# Altium project ValveBoard - Copy.PrjPcb (part 2 of 2)

## Sheet VALVEBOARD_ValvePower.SchDoc
size A4; SheetNumber: 4; SheetTotal: 9
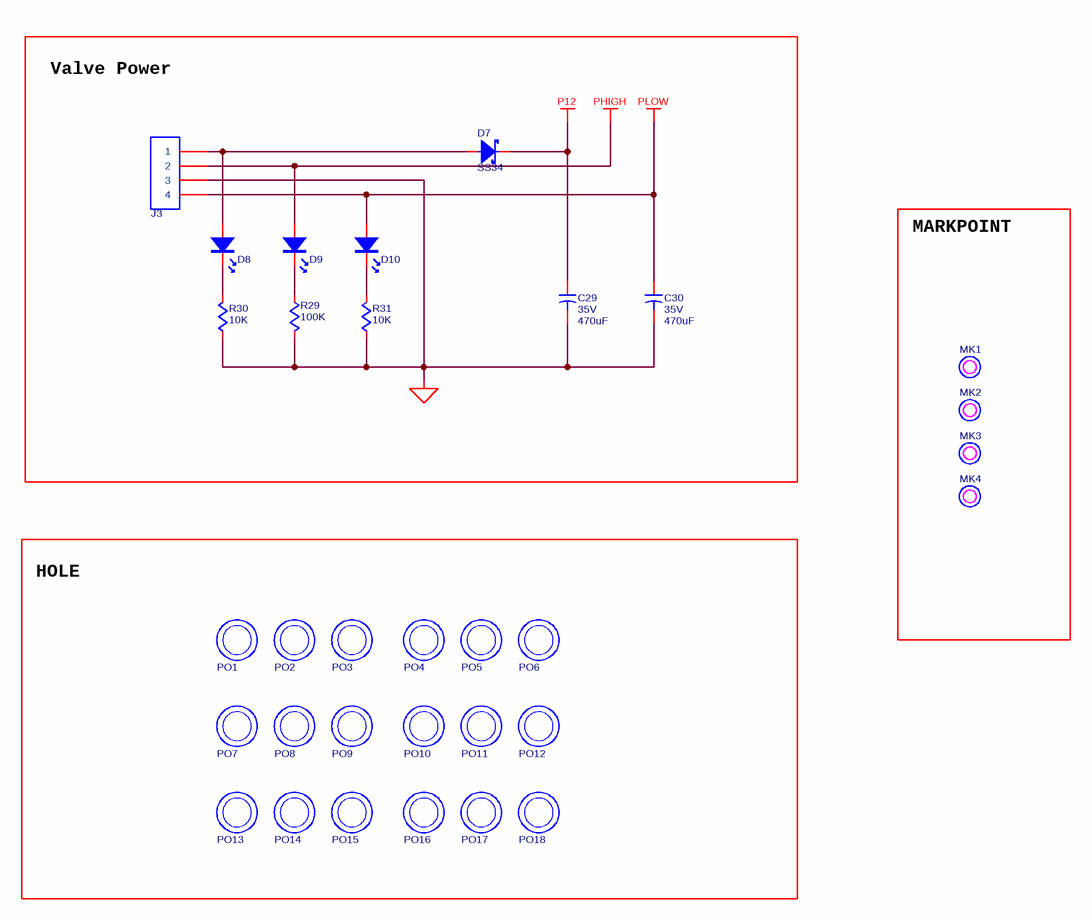
[diagram p8: VALVEBOARD_ValvePower.SchDoc]

### Parts
C29  value 470uF  voltage: 35V  [C_10_10R2]  (hidden comment: C-POL)
C30  value 470uF  voltage: 35V  [C_10_10R2]  (hidden comment: C-POL)
D7  SS34  [SS34]
D8  LED  [LED0603]  (value not drawn)
D9  LED  [LED0603]  (value not drawn)
D10  LED  [LED0603]  (value not drawn)
J3  HDR1X4  [KF301-5.0-4P]  (value not drawn)
MK1  MARKPOINT  [MARKPOINT-1.0]  (value not drawn)
MK2  MARKPOINT  [MARKPOINT-1.0]  (value not drawn)
MK3  MARKPOINT  [MARKPOINT-1.0]  (value not drawn)
MK4  MARKPOINT  [MARKPOINT-1.0]  (value not drawn)
PO1  POSHOLE  [POSHOLE-3.2]  (value not drawn)
PO2  POSHOLE  [POSHOLE-3.2]  (value not drawn)
PO3  POSHOLE  [POSHOLE-3.2]  (value not drawn)
PO4  POSHOLE  [POSHOLE-3.2]  (value not drawn)
PO5  POSHOLE  [POSHOLE-3.2]  (value not drawn)
PO6  POSHOLE  [POSHOLE-3.2]  (value not drawn)
PO7  POSHOLE  [POSHOLE-3.2]  (value not drawn)
PO8  POSHOLE  [POSHOLE-3.2]  (value not drawn)
PO9  POSHOLE  [POSHOLE-3.2]  (value not drawn)
PO10  POSHOLE  [POSHOLE-3.2]  (value not drawn)
PO11  POSHOLE  [POSHOLE-3.2]  (value not drawn)
PO12  POSHOLE  [POSHOLE-3.2]  (value not drawn)
PO13  POSHOLE  [POSHOLE-3.2]  (value not drawn)
PO14  POSHOLE  [POSHOLE-3.2]  (value not drawn)
PO15  POSHOLE  [POSHOLE-3.2]  (value not drawn)
PO16  POSHOLE  [POSHOLE-3.2]  (value not drawn)
PO17  POSHOLE  [POSHOLE-3.2]  (value not drawn)
PO18  POSHOLE  [POSHOLE-3.2]  (value not drawn)
R29  value 100K  [R1206]  (hidden comment: R)
R30  value 10K  [R0805]  (hidden comment: R)
R31  value 10K  [R0805]  (hidden comment: R)

### Blocks framed on the sheet
Valve Power: C29 C30 D7-D10 J3 R29-R31
MARKPOINT: MK1-MK4
HOLE: PO1-PO18

### Nets
P12: C29.1(S) D7.1
PGND: C29.2 C30.2 J3.3 R29.1 R30.2 R31.2
PHIGH: D9.2 J3.2
PLOW: C30.1(S) D10.2 J3.4
NetD7_2: D7.2 D8.2 J3.1
NetD8_1: D8.1 R30.1
NetD9_1: D9.1 R29.2
NetD10_1: D10.1 R31.1

### Library data of the parts
R29-R31 = R: precision: 1%
D7 = SS34: Supplier 1: LCSC; Supplier Part Number 1: C8678

## Nets that join several sheets
DGND: VALVEBOARD_Controller (35 pins), VALVEBOARD_DigitalInterface (13 pins), VALVEBOARD_DigitalPower (29 pins)
P12: PostIsolation1/Isolation (16 pins), PostIsolation2/Isolation (16 pins), PostIsolation3/Isolation (16 pins), PostIsolation4/Isolation (16 pins), PostIsolation5/Isolation (16 pins), PostIsolation6/Isolation (16 pins), PostIsolation7/Isolation (16 pins), PostIsolation8/Isolation (16 pins), PostIsolation9/Isolation (16 pins), PostIsolation10/Isolation (16 pins), PostIsolation11/Isolation (16 pins), PostIsolation12/Isolation (16 pins), VALVEBOARD_ValvePower (C29.1 D7.1)
PGND: PostIsolation1/Isolation (8 pins), PostIsolation1/Drive1 (7 pins), PostIsolation1/Drive2 (7 pins), PostIsolation1/Drive3 (7 pins), PostIsolation1/Drive4 (7 pins), PostIsolation2/Isolation (8 pins), PostIsolation2/Drive1 (7 pins), PostIsolation2/Drive2 (7 pins), PostIsolation2/Drive3 (7 pins), PostIsolation2/Drive4 (7 pins), PostIsolation3/Isolation (8 pins), PostIsolation3/Drive1 (7 pins), PostIsolation3/Drive2 (7 pins), PostIsolation3/Drive3 (7 pins), PostIsolation3/Drive4 (7 pins), PostIsolation4/Isolation (8 pins), PostIsolation4/Drive1 (7 pins), PostIsolation4/Drive2 (7 pins), PostIsolation4/Drive3 (7 pins), PostIsolation4/Drive4 (7 pins), PostIsolation5/Isolation (8 pins), PostIsolation5/Drive1 (7 pins), PostIsolation5/Drive2 (7 pins), PostIsolation5/Drive3 (7 pins), PostIsolation5/Drive4 (7 pins), PostIsolation6/Isolation (8 pins), PostIsolation6/Drive1 (7 pins), PostIsolation6/Drive2 (7 pins), PostIsolation6/Drive3 (7 pins), PostIsolation6/Drive4 (7 pins), PostIsolation7/Isolation (8 pins), PostIsolation7/Drive1 (7 pins), PostIsolation7/Drive2 (7 pins), PostIsolation7/Drive3 (7 pins), PostIsolation7/Drive4 (7 pins), PostIsolation8/Isolation (8 pins), PostIsolation8/Drive1 (7 pins), PostIsolation8/Drive2 (7 pins), PostIsolation8/Drive3 (7 pins), PostIsolation8/Drive4 (7 pins), PostIsolation9/Isolation (8 pins), PostIsolation9/Drive1 (7 pins), PostIsolation9/Drive2 (7 pins), PostIsolation9/Drive3 (7 pins), PostIsolation9/Drive4 (7 pins), PostIsolation10/Isolation (8 pins), PostIsolation10/Drive1 (7 pins), PostIsolation10/Drive2 (7 pins), PostIsolation10/Drive3 (7 pins), PostIsolation10/Drive4 (7 pins), PostIsolation11/Isolation (8 pins), PostIsolation11/Drive1 (7 pins), PostIsolation11/Drive2 (7 pins), PostIsolation11/Drive3 (7 pins), PostIsolation11/Drive4 (7 pins), PostIsolation12/Isolation (8 pins), PostIsolation12/Drive1 (7 pins), PostIsolation12/Drive2 (7 pins), PostIsolation12/Drive3 (7 pins), PostIsolation12/Drive4 (7 pins), VALVEBOARD_ValvePower (6 pins)
PHIGH: PostIsolation1/Drive1 (D5_PostIsolation1_Drive1.1 Q1_PostIsolation1_Drive1.3 R22_PostIsolation1_Drive1.2 R23_PostIsolation1_Drive1.2), PostIsolation1/Drive2 (D5_PostIsolation1_Drive2.1 Q1_PostIsolation1_Drive2.3 R22_PostIsolation1_Drive2.2 R23_PostIsolation1_Drive2.2), PostIsolation1/Drive3 (D5_PostIsolation1_Drive3.1 Q1_PostIsolation1_Drive3.3 R22_PostIsolation1_Drive3.2 R23_PostIsolation1_Drive3.2), PostIsolation1/Drive4 (D5_PostIsolation1_Drive4.1 Q1_PostIsolation1_Drive4.3 R22_PostIsolation1_Drive4.2 R23_PostIsolation1_Drive4.2), PostIsolation2/Drive1 (D5_PostIsolation2_Drive1.1 Q1_PostIsolation2_Drive1.3 R22_PostIsolation2_Drive1.2 R23_PostIsolation2_Drive1.2), PostIsolation2/Drive2 (D5_PostIsolation2_Drive2.1 Q1_PostIsolation2_Drive2.3 R22_PostIsolation2_Drive2.2 R23_PostIsolation2_Drive2.2), PostIsolation2/Drive3 (D5_PostIsolation2_Drive3.1 Q1_PostIsolation2_Drive3.3 R22_PostIsolation2_Drive3.2 R23_PostIsolation2_Drive3.2), PostIsolation2/Drive4 (D5_PostIsolation2_Drive4.1 Q1_PostIsolation2_Drive4.3 R22_PostIsolation2_Drive4.2 R23_PostIsolation2_Drive4.2), PostIsolation3/Drive1 (D5_PostIsolation3_Drive1.1 Q1_PostIsolation3_Drive1.3 R22_PostIsolation3_Drive1.2 R23_PostIsolation3_Drive1.2), PostIsolation3/Drive2 (D5_PostIsolation3_Drive2.1 Q1_PostIsolation3_Drive2.3 R22_PostIsolation3_Drive2.2 R23_PostIsolation3_Drive2.2), PostIsolation3/Drive3 (D5_PostIsolation3_Drive3.1 Q1_PostIsolation3_Drive3.3 R22_PostIsolation3_Drive3.2 R23_PostIsolation3_Drive3.2), PostIsolation3/Drive4 (D5_PostIsolation3_Drive4.1 Q1_PostIsolation3_Drive4.3 R22_PostIsolation3_Drive4.2 R23_PostIsolation3_Drive4.2), PostIsolation4/Drive1 (D5_PostIsolation4_Drive1.1 Q1_PostIsolation4_Drive1.3 R22_PostIsolation4_Drive1.2 R23_PostIsolation4_Drive1.2), PostIsolation4/Drive2 (D5_PostIsolation4_Drive2.1 Q1_PostIsolation4_Drive2.3 R22_PostIsolation4_Drive2.2 R23_PostIsolation4_Drive2.2), PostIsolation4/Drive3 (D5_PostIsolation4_Drive3.1 Q1_PostIsolation4_Drive3.3 R22_PostIsolation4_Drive3.2 R23_PostIsolation4_Drive3.2), PostIsolation4/Drive4 (D5_PostIsolation4_Drive4.1 Q1_PostIsolation4_Drive4.3 R22_PostIsolation4_Drive4.2 R23_PostIsolation4_Drive4.2), PostIsolation5/Drive1 (D5_PostIsolation5_Drive1.1 Q1_PostIsolation5_Drive1.3 R22_PostIsolation5_Drive1.2 R23_PostIsolation5_Drive1.2), PostIsolation5/Drive2 (D5_PostIsolation5_Drive2.1 Q1_PostIsolation5_Drive2.3 R22_PostIsolation5_Drive2.2 R23_PostIsolation5_Drive2.2), PostIsolation5/Drive3 (D5_PostIsolation5_Drive3.1 Q1_PostIsolation5_Drive3.3 R22_PostIsolation5_Drive3.2 R23_PostIsolation5_Drive3.2), PostIsolation5/Drive4 (D5_PostIsolation5_Drive4.1 Q1_PostIsolation5_Drive4.3 R22_PostIsolation5_Drive4.2 R23_PostIsolation5_Drive4.2), PostIsolation6/Drive1 (D5_PostIsolation6_Drive1.1 Q1_PostIsolation6_Drive1.3 R22_PostIsolation6_Drive1.2 R23_PostIsolation6_Drive1.2), PostIsolation6/Drive2 (D5_PostIsolation6_Drive2.1 Q1_PostIsolation6_Drive2.3 R22_PostIsolation6_Drive2.2 R23_PostIsolation6_Drive2.2), PostIsolation6/Drive3 (D5_PostIsolation6_Drive3.1 Q1_PostIsolation6_Drive3.3 R22_PostIsolation6_Drive3.2 R23_PostIsolation6_Drive3.2), PostIsolation6/Drive4 (D5_PostIsolation6_Drive4.1 Q1_PostIsolation6_Drive4.3 R22_PostIsolation6_Drive4.2 R23_PostIsolation6_Drive4.2), PostIsolation7/Drive1 (D5_PostIsolation7_Drive1.1 Q1_PostIsolation7_Drive1.3 R22_PostIsolation7_Drive1.2 R23_PostIsolation7_Drive1.2), PostIsolation7/Drive2 (D5_PostIsolation7_Drive2.1 Q1_PostIsolation7_Drive2.3 R22_PostIsolation7_Drive2.2 R23_PostIsolation7_Drive2.2), PostIsolation7/Drive3 (D5_PostIsolation7_Drive3.1 Q1_PostIsolation7_Drive3.3 R22_PostIsolation7_Drive3.2 R23_PostIsolation7_Drive3.2), PostIsolation7/Drive4 (D5_PostIsolation7_Drive4.1 Q1_PostIsolation7_Drive4.3 R22_PostIsolation7_Drive4.2 R23_PostIsolation7_Drive4.2), PostIsolation8/Drive1 (D5_PostIsolation8_Drive1.1 Q1_PostIsolation8_Drive1.3 R22_PostIsolation8_Drive1.2 R23_PostIsolation8_Drive1.2), PostIsolation8/Drive2 (D5_PostIsolation8_Drive2.1 Q1_PostIsolation8_Drive2.3 R22_PostIsolation8_Drive2.2 R23_PostIsolation8_Drive2.2), PostIsolation8/Drive3 (D5_PostIsolation8_Drive3.1 Q1_PostIsolation8_Drive3.3 R22_PostIsolation8_Drive3.2 R23_PostIsolation8_Drive3.2), PostIsolation8/Drive4 (D5_PostIsolation8_Drive4.1 Q1_PostIsolation8_Drive4.3 R22_PostIsolation8_Drive4.2 R23_PostIsolation8_Drive4.2), PostIsolation9/Drive1 (D5_PostIsolation9_Drive1.1 Q1_PostIsolation9_Drive1.3 R22_PostIsolation9_Drive1.2 R23_PostIsolation9_Drive1.2), PostIsolation9/Drive2 (D5_PostIsolation9_Drive2.1 Q1_PostIsolation9_Drive2.3 R22_PostIsolation9_Drive2.2 R23_PostIsolation9_Drive2.2), PostIsolation9/Drive3 (D5_PostIsolation9_Drive3.1 Q1_PostIsolation9_Drive3.3 R22_PostIsolation9_Drive3.2 R23_PostIsolation9_Drive3.2), PostIsolation9/Drive4 (D5_PostIsolation9_Drive4.1 Q1_PostIsolation9_Drive4.3 R22_PostIsolation9_Drive4.2 R23_PostIsolation9_Drive4.2), PostIsolation10/Drive1 (D5_PostIsolation10_Drive1.1 Q1_PostIsolation10_Drive1.3 R22_PostIsolation10_Drive1.2 R23_PostIsolation10_Drive1.2), PostIsolation10/Drive2 (D5_PostIsolation10_Drive2.1 Q1_PostIsolation10_Drive2.3 R22_PostIsolation10_Drive2.2 R23_PostIsolation10_Drive2.2), PostIsolation10/Drive3 (D5_PostIsolation10_Drive3.1 Q1_PostIsolation10_Drive3.3 R22_PostIsolation10_Drive3.2 R23_PostIsolation10_Drive3.2), PostIsolation10/Drive4 (D5_PostIsolation10_Drive4.1 Q1_PostIsolation10_Drive4.3 R22_PostIsolation10_Drive4.2 R23_PostIsolation10_Drive4.2), PostIsolation11/Drive1 (D5_PostIsolation11_Drive1.1 Q1_PostIsolation11_Drive1.3 R22_PostIsolation11_Drive1.2 R23_PostIsolation11_Drive1.2), PostIsolation11/Drive2 (D5_PostIsolation11_Drive2.1 Q1_PostIsolation11_Drive2.3 R22_PostIsolation11_Drive2.2 R23_PostIsolation11_Drive2.2), PostIsolation11/Drive3 (D5_PostIsolation11_Drive3.1 Q1_PostIsolation11_Drive3.3 R22_PostIsolation11_Drive3.2 R23_PostIsolation11_Drive3.2), PostIsolation11/Drive4 (D5_PostIsolation11_Drive4.1 Q1_PostIsolation11_Drive4.3 R22_PostIsolation11_Drive4.2 R23_PostIsolation11_Drive4.2), PostIsolation12/Drive1 (D5_PostIsolation12_Drive1.1 Q1_PostIsolation12_Drive1.3 R22_PostIsolation12_Drive1.2 R23_PostIsolation12_Drive1.2), PostIsolation12/Drive2 (D5_PostIsolation12_Drive2.1 Q1_PostIsolation12_Drive2.3 R22_PostIsolation12_Drive2.2 R23_PostIsolation12_Drive2.2), PostIsolation12/Drive3 (D5_PostIsolation12_Drive3.1 Q1_PostIsolation12_Drive3.3 R22_PostIsolation12_Drive3.2 R23_PostIsolation12_Drive3.2), PostIsolation12/Drive4 (D5_PostIsolation12_Drive4.1 Q1_PostIsolation12_Drive4.3 R22_PostIsolation12_Drive4.2 R23_PostIsolation12_Drive4.2), VALVEBOARD_ValvePower (D9.2 J3.2)
PLOW: PostIsolation1/Drive1 (D6_PostIsolation1_Drive1.2), PostIsolation1/Drive2 (D6_PostIsolation1_Drive2.2), PostIsolation1/Drive3 (D6_PostIsolation1_Drive3.2), PostIsolation1/Drive4 (D6_PostIsolation1_Drive4.2), PostIsolation2/Drive1 (D6_PostIsolation2_Drive1.2), PostIsolation2/Drive2 (D6_PostIsolation2_Drive2.2), PostIsolation2/Drive3 (D6_PostIsolation2_Drive3.2), PostIsolation2/Drive4 (D6_PostIsolation2_Drive4.2), PostIsolation3/Drive1 (D6_PostIsolation3_Drive1.2), PostIsolation3/Drive2 (D6_PostIsolation3_Drive2.2), PostIsolation3/Drive3 (D6_PostIsolation3_Drive3.2), PostIsolation3/Drive4 (D6_PostIsolation3_Drive4.2), PostIsolation4/Drive1 (D6_PostIsolation4_Drive1.2), PostIsolation4/Drive2 (D6_PostIsolation4_Drive2.2), PostIsolation4/Drive3 (D6_PostIsolation4_Drive3.2), PostIsolation4/Drive4 (D6_PostIsolation4_Drive4.2), PostIsolation5/Drive1 (D6_PostIsolation5_Drive1.2), PostIsolation5/Drive2 (D6_PostIsolation5_Drive2.2), PostIsolation5/Drive3 (D6_PostIsolation5_Drive3.2), PostIsolation5/Drive4 (D6_PostIsolation5_Drive4.2), PostIsolation6/Drive1 (D6_PostIsolation6_Drive1.2), PostIsolation6/Drive2 (D6_PostIsolation6_Drive2.2), PostIsolation6/Drive3 (D6_PostIsolation6_Drive3.2), PostIsolation6/Drive4 (D6_PostIsolation6_Drive4.2), PostIsolation7/Drive1 (D6_PostIsolation7_Drive1.2), PostIsolation7/Drive2 (D6_PostIsolation7_Drive2.2), PostIsolation7/Drive3 (D6_PostIsolation7_Drive3.2), PostIsolation7/Drive4 (D6_PostIsolation7_Drive4.2), PostIsolation8/Drive1 (D6_PostIsolation8_Drive1.2), PostIsolation8/Drive2 (D6_PostIsolation8_Drive2.2), PostIsolation8/Drive3 (D6_PostIsolation8_Drive3.2), PostIsolation8/Drive4 (D6_PostIsolation8_Drive4.2), PostIsolation9/Drive1 (D6_PostIsolation9_Drive1.2), PostIsolation9/Drive2 (D6_PostIsolation9_Drive2.2), PostIsolation9/Drive3 (D6_PostIsolation9_Drive3.2), PostIsolation9/Drive4 (D6_PostIsolation9_Drive4.2), PostIsolation10/Drive1 (D6_PostIsolation10_Drive1.2), PostIsolation10/Drive2 (D6_PostIsolation10_Drive2.2), PostIsolation10/Drive3 (D6_PostIsolation10_Drive3.2), PostIsolation10/Drive4 (D6_PostIsolation10_Drive4.2), PostIsolation11/Drive1 (D6_PostIsolation11_Drive1.2), PostIsolation11/Drive2 (D6_PostIsolation11_Drive2.2), PostIsolation11/Drive3 (D6_PostIsolation11_Drive3.2), PostIsolation11/Drive4 (D6_PostIsolation11_Drive4.2), PostIsolation12/Drive1 (D6_PostIsolation12_Drive1.2), PostIsolation12/Drive2 (D6_PostIsolation12_Drive2.2), PostIsolation12/Drive3 (D6_PostIsolation12_Drive3.2), PostIsolation12/Drive4 (D6_PostIsolation12_Drive4.2), VALVEBOARD_ValvePower (C30.1 D10.2 J3.4)
VCC3.3: VALVEBOARD_Controller (34 pins), VALVEBOARD_DigitalInterface (8 pins), VALVEBOARD_DigitalPower (10 pins)
VCC3.3GG: PostIsolation1/Isolation (8 pins), PostIsolation2/Isolation (8 pins), PostIsolation3/Isolation (8 pins), PostIsolation4/Isolation (8 pins), PostIsolation5/Isolation (8 pins), PostIsolation6/Isolation (8 pins), PostIsolation7/Isolation (8 pins), PostIsolation8/Isolation (8 pins), PostIsolation9/Isolation (8 pins), PostIsolation10/Isolation (8 pins), PostIsolation11/Isolation (8 pins), PostIsolation12/Isolation (8 pins), VALVEBOARD_DigitalPower (C39.2 LED1.2 Q4.D R43.2)
DLO1_PostIsolation1: PostIsolation1/Interface (C23_PostIsolation1_Interface.2 J2_PostIsolation1_Interface.1), PostIsolation1/Drive1 (Q2_PostIsolation1_Drive1.2)
DLO1_PostIsolation2: PostIsolation2/Interface (C23_PostIsolation2_Interface.2 J2_PostIsolation2_Interface.1), PostIsolation2/Drive1 (Q2_PostIsolation2_Drive1.2)
DLO1_PostIsolation3: PostIsolation3/Interface (C23_PostIsolation3_Interface.2 J2_PostIsolation3_Interface.1), PostIsolation3/Drive1 (Q2_PostIsolation3_Drive1.2)
DLO1_PostIsolation4: PostIsolation4/Interface (C23_PostIsolation4_Interface.2 J2_PostIsolation4_Interface.1), PostIsolation4/Drive1 (Q2_PostIsolation4_Drive1.2)
DLO1_PostIsolation5: PostIsolation5/Interface (C23_PostIsolation5_Interface.2 J2_PostIsolation5_Interface.1), PostIsolation5/Drive1 (Q2_PostIsolation5_Drive1.2)
DLO1_PostIsolation6: PostIsolation6/Interface (C23_PostIsolation6_Interface.2 J2_PostIsolation6_Interface.1), PostIsolation6/Drive1 (Q2_PostIsolation6_Drive1.2)
DLO1_PostIsolation7: PostIsolation7/Interface (C23_PostIsolation7_Interface.2 J2_PostIsolation7_Interface.1), PostIsolation7/Drive1 (Q2_PostIsolation7_Drive1.2)
DLO1_PostIsolation8: PostIsolation8/Interface (C23_PostIsolation8_Interface.2 J2_PostIsolation8_Interface.1), PostIsolation8/Drive1 (Q2_PostIsolation8_Drive1.2)
DLO1_PostIsolation9: PostIsolation9/Interface (C23_PostIsolation9_Interface.2 J2_PostIsolation9_Interface.1), PostIsolation9/Drive1 (Q2_PostIsolation9_Drive1.2)
DLO1_PostIsolation10: PostIsolation10/Interface (C23_PostIsolation10_Interface.2 J2_PostIsolation10_Interface.1), PostIsolation10/Drive1 (Q2_PostIsolation10_Drive1.2)
DLO1_PostIsolation11: PostIsolation11/Interface (C23_PostIsolation11_Interface.2 J2_PostIsolation11_Interface.1), PostIsolation11/Drive1 (Q2_PostIsolation11_Drive1.2)
DLO1_PostIsolation12: PostIsolation12/Interface (C23_PostIsolation12_Interface.2 J2_PostIsolation12_Interface.1), PostIsolation12/Drive1 (Q2_PostIsolation12_Drive1.2)
DLO2_PostIsolation1: PostIsolation1/Interface (C24_PostIsolation1_Interface.2 J2_PostIsolation1_Interface.3), PostIsolation1/Drive2 (Q2_PostIsolation1_Drive2.2)
DLO2_PostIsolation2: PostIsolation2/Interface (C24_PostIsolation2_Interface.2 J2_PostIsolation2_Interface.3), PostIsolation2/Drive2 (Q2_PostIsolation2_Drive2.2)
DLO2_PostIsolation3: PostIsolation3/Interface (C24_PostIsolation3_Interface.2 J2_PostIsolation3_Interface.3), PostIsolation3/Drive2 (Q2_PostIsolation3_Drive2.2)
DLO2_PostIsolation4: PostIsolation4/Interface (C24_PostIsolation4_Interface.2 J2_PostIsolation4_Interface.3), PostIsolation4/Drive2 (Q2_PostIsolation4_Drive2.2)
DLO2_PostIsolation5: PostIsolation5/Interface (C24_PostIsolation5_Interface.2 J2_PostIsolation5_Interface.3), PostIsolation5/Drive2 (Q2_PostIsolation5_Drive2.2)
DLO2_PostIsolation6: PostIsolation6/Interface (C24_PostIsolation6_Interface.2 J2_PostIsolation6_Interface.3), PostIsolation6/Drive2 (Q2_PostIsolation6_Drive2.2)
DLO2_PostIsolation7: PostIsolation7/Interface (C24_PostIsolation7_Interface.2 J2_PostIsolation7_Interface.3), PostIsolation7/Drive2 (Q2_PostIsolation7_Drive2.2)
DLO2_PostIsolation8: PostIsolation8/Interface (C24_PostIsolation8_Interface.2 J2_PostIsolation8_Interface.3), PostIsolation8/Drive2 (Q2_PostIsolation8_Drive2.2)
DLO2_PostIsolation9: PostIsolation9/Interface (C24_PostIsolation9_Interface.2 J2_PostIsolation9_Interface.3), PostIsolation9/Drive2 (Q2_PostIsolation9_Drive2.2)
DLO2_PostIsolation10: PostIsolation10/Interface (C24_PostIsolation10_Interface.2 J2_PostIsolation10_Interface.3), PostIsolation10/Drive2 (Q2_PostIsolation10_Drive2.2)
DLO2_PostIsolation11: PostIsolation11/Interface (C24_PostIsolation11_Interface.2 J2_PostIsolation11_Interface.3), PostIsolation11/Drive2 (Q2_PostIsolation11_Drive2.2)
DLO2_PostIsolation12: PostIsolation12/Interface (C24_PostIsolation12_Interface.2 J2_PostIsolation12_Interface.3), PostIsolation12/Drive2 (Q2_PostIsolation12_Drive2.2)
DLO3_PostIsolation1: PostIsolation1/Interface (C25_PostIsolation1_Interface.2 J2_PostIsolation1_Interface.5), PostIsolation1/Drive3 (Q2_PostIsolation1_Drive3.2)
DLO3_PostIsolation2: PostIsolation2/Interface (C25_PostIsolation2_Interface.2 J2_PostIsolation2_Interface.5), PostIsolation2/Drive3 (Q2_PostIsolation2_Drive3.2)
DLO3_PostIsolation3: PostIsolation3/Interface (C25_PostIsolation3_Interface.2 J2_PostIsolation3_Interface.5), PostIsolation3/Drive3 (Q2_PostIsolation3_Drive3.2)
DLO3_PostIsolation4: PostIsolation4/Interface (C25_PostIsolation4_Interface.2 J2_PostIsolation4_Interface.5), PostIsolation4/Drive3 (Q2_PostIsolation4_Drive3.2)
DLO3_PostIsolation5: PostIsolation5/Interface (C25_PostIsolation5_Interface.2 J2_PostIsolation5_Interface.5), PostIsolation5/Drive3 (Q2_PostIsolation5_Drive3.2)
DLO3_PostIsolation6: PostIsolation6/Interface (C25_PostIsolation6_Interface.2 J2_PostIsolation6_Interface.5), PostIsolation6/Drive3 (Q2_PostIsolation6_Drive3.2)
DLO3_PostIsolation7: PostIsolation7/Interface (C25_PostIsolation7_Interface.2 J2_PostIsolation7_Interface.5), PostIsolation7/Drive3 (Q2_PostIsolation7_Drive3.2)
DLO3_PostIsolation8: PostIsolation8/Interface (C25_PostIsolation8_Interface.2 J2_PostIsolation8_Interface.5), PostIsolation8/Drive3 (Q2_PostIsolation8_Drive3.2)
DLO3_PostIsolation9: PostIsolation9/Interface (C25_PostIsolation9_Interface.2 J2_PostIsolation9_Interface.5), PostIsolation9/Drive3 (Q2_PostIsolation9_Drive3.2)
DLO3_PostIsolation10: PostIsolation10/Interface (C25_PostIsolation10_Interface.2 J2_PostIsolation10_Interface.5), PostIsolation10/Drive3 (Q2_PostIsolation10_Drive3.2)
DLO3_PostIsolation11: PostIsolation11/Interface (C25_PostIsolation11_Interface.2 J2_PostIsolation11_Interface.5), PostIsolation11/Drive3 (Q2_PostIsolation11_Drive3.2)
DLO3_PostIsolation12: PostIsolation12/Interface (C25_PostIsolation12_Interface.2 J2_PostIsolation12_Interface.5), PostIsolation12/Drive3 (Q2_PostIsolation12_Drive3.2)
DLO4_PostIsolation1: PostIsolation1/Interface (C26_PostIsolation1_Interface.2 J2_PostIsolation1_Interface.7), PostIsolation1/Drive4 (Q2_PostIsolation1_Drive4.2)
DLO4_PostIsolation2: PostIsolation2/Interface (C26_PostIsolation2_Interface.2 J2_PostIsolation2_Interface.7), PostIsolation2/Drive4 (Q2_PostIsolation2_Drive4.2)
DLO4_PostIsolation3: PostIsolation3/Interface (C26_PostIsolation3_Interface.2 J2_PostIsolation3_Interface.7), PostIsolation3/Drive4 (Q2_PostIsolation3_Drive4.2)
DLO4_PostIsolation4: PostIsolation4/Interface (C26_PostIsolation4_Interface.2 J2_PostIsolation4_Interface.7), PostIsolation4/Drive4 (Q2_PostIsolation4_Drive4.2)
DLO4_PostIsolation5: PostIsolation5/Interface (C26_PostIsolation5_Interface.2 J2_PostIsolation5_Interface.7), PostIsolation5/Drive4 (Q2_PostIsolation5_Drive4.2)
DLO4_PostIsolation6: PostIsolation6/Interface (C26_PostIsolation6_Interface.2 J2_PostIsolation6_Interface.7), PostIsolation6/Drive4 (Q2_PostIsolation6_Drive4.2)
DLO4_PostIsolation7: PostIsolation7/Interface (C26_PostIsolation7_Interface.2 J2_PostIsolation7_Interface.7), PostIsolation7/Drive4 (Q2_PostIsolation7_Drive4.2)
DLO4_PostIsolation8: PostIsolation8/Interface (C26_PostIsolation8_Interface.2 J2_PostIsolation8_Interface.7), PostIsolation8/Drive4 (Q2_PostIsolation8_Drive4.2)
DLO4_PostIsolation9: PostIsolation9/Interface (C26_PostIsolation9_Interface.2 J2_PostIsolation9_Interface.7), PostIsolation9/Drive4 (Q2_PostIsolation9_Drive4.2)
DLO4_PostIsolation10: PostIsolation10/Interface (C26_PostIsolation10_Interface.2 J2_PostIsolation10_Interface.7), PostIsolation10/Drive4 (Q2_PostIsolation10_Drive4.2)
DLO4_PostIsolation11: PostIsolation11/Interface (C26_PostIsolation11_Interface.2 J2_PostIsolation11_Interface.7), PostIsolation11/Drive4 (Q2_PostIsolation11_Drive4.2)
DLO4_PostIsolation12: PostIsolation12/Interface (C26_PostIsolation12_Interface.2 J2_PostIsolation12_Interface.7), PostIsolation12/Drive4 (Q2_PostIsolation12_Drive4.2)
DUO1_PostIsolation1: PostIsolation1/Interface (C23_PostIsolation1_Interface.1 J2_PostIsolation1_Interface.2), PostIsolation1/Drive1 (D6_PostIsolation1_Drive1.1 Q1_PostIsolation1_Drive1.2 R23_PostIsolation1_Drive1.1)
DUO1_PostIsolation2: PostIsolation2/Interface (C23_PostIsolation2_Interface.1 J2_PostIsolation2_Interface.2), PostIsolation2/Drive1 (D6_PostIsolation2_Drive1.1 Q1_PostIsolation2_Drive1.2 R23_PostIsolation2_Drive1.1)
DUO1_PostIsolation3: PostIsolation3/Interface (C23_PostIsolation3_Interface.1 J2_PostIsolation3_Interface.2), PostIsolation3/Drive1 (D6_PostIsolation3_Drive1.1 Q1_PostIsolation3_Drive1.2 R23_PostIsolation3_Drive1.1)
DUO1_PostIsolation4: PostIsolation4/Interface (C23_PostIsolation4_Interface.1 J2_PostIsolation4_Interface.2), PostIsolation4/Drive1 (D6_PostIsolation4_Drive1.1 Q1_PostIsolation4_Drive1.2 R23_PostIsolation4_Drive1.1)
DUO1_PostIsolation5: PostIsolation5/Interface (C23_PostIsolation5_Interface.1 J2_PostIsolation5_Interface.2), PostIsolation5/Drive1 (D6_PostIsolation5_Drive1.1 Q1_PostIsolation5_Drive1.2 R23_PostIsolation5_Drive1.1)
DUO1_PostIsolation6: PostIsolation6/Interface (C23_PostIsolation6_Interface.1 J2_PostIsolation6_Interface.2), PostIsolation6/Drive1 (D6_PostIsolation6_Drive1.1 Q1_PostIsolation6_Drive1.2 R23_PostIsolation6_Drive1.1)
DUO1_PostIsolation7: PostIsolation7/Interface (C23_PostIsolation7_Interface.1 J2_PostIsolation7_Interface.2), PostIsolation7/Drive1 (D6_PostIsolation7_Drive1.1 Q1_PostIsolation7_Drive1.2 R23_PostIsolation7_Drive1.1)
DUO1_PostIsolation8: PostIsolation8/Interface (C23_PostIsolation8_Interface.1 J2_PostIsolation8_Interface.2), PostIsolation8/Drive1 (D6_PostIsolation8_Drive1.1 Q1_PostIsolation8_Drive1.2 R23_PostIsolation8_Drive1.1)
DUO1_PostIsolation9: PostIsolation9/Interface (C23_PostIsolation9_Interface.1 J2_PostIsolation9_Interface.2), PostIsolation9/Drive1 (D6_PostIsolation9_Drive1.1 Q1_PostIsolation9_Drive1.2 R23_PostIsolation9_Drive1.1)
DUO1_PostIsolation10: PostIsolation10/Interface (C23_PostIsolation10_Interface.1 J2_PostIsolation10_Interface.2), PostIsolation10/Drive1 (D6_PostIsolation10_Drive1.1 Q1_PostIsolation10_Drive1.2 R23_PostIsolation10_Drive1.1)
DUO1_PostIsolation11: PostIsolation11/Interface (C23_PostIsolation11_Interface.1 J2_PostIsolation11_Interface.2), PostIsolation11/Drive1 (D6_PostIsolation11_Drive1.1 Q1_PostIsolation11_Drive1.2 R23_PostIsolation11_Drive1.1)
DUO1_PostIsolation12: PostIsolation12/Interface (C23_PostIsolation12_Interface.1 J2_PostIsolation12_Interface.2), PostIsolation12/Drive1 (D6_PostIsolation12_Drive1.1 Q1_PostIsolation12_Drive1.2 R23_PostIsolation12_Drive1.1)
DUO2_PostIsolation1: PostIsolation1/Interface (C24_PostIsolation1_Interface.1 J2_PostIsolation1_Interface.4), PostIsolation1/Drive2 (D6_PostIsolation1_Drive2.1 Q1_PostIsolation1_Drive2.2 R23_PostIsolation1_Drive2.1)
DUO2_PostIsolation2: PostIsolation2/Interface (C24_PostIsolation2_Interface.1 J2_PostIsolation2_Interface.4), PostIsolation2/Drive2 (D6_PostIsolation2_Drive2.1 Q1_PostIsolation2_Drive2.2 R23_PostIsolation2_Drive2.1)
DUO2_PostIsolation3: PostIsolation3/Interface (C24_PostIsolation3_Interface.1 J2_PostIsolation3_Interface.4), PostIsolation3/Drive2 (D6_PostIsolation3_Drive2.1 Q1_PostIsolation3_Drive2.2 R23_PostIsolation3_Drive2.1)
DUO2_PostIsolation4: PostIsolation4/Interface (C24_PostIsolation4_Interface.1 J2_PostIsolation4_Interface.4), PostIsolation4/Drive2 (D6_PostIsolation4_Drive2.1 Q1_PostIsolation4_Drive2.2 R23_PostIsolation4_Drive2.1)
DUO2_PostIsolation5: PostIsolation5/Interface (C24_PostIsolation5_Interface.1 J2_PostIsolation5_Interface.4), PostIsolation5/Drive2 (D6_PostIsolation5_Drive2.1 Q1_PostIsolation5_Drive2.2 R23_PostIsolation5_Drive2.1)
DUO2_PostIsolation6: PostIsolation6/Interface (C24_PostIsolation6_Interface.1 J2_PostIsolation6_Interface.4), PostIsolation6/Drive2 (D6_PostIsolation6_Drive2.1 Q1_PostIsolation6_Drive2.2 R23_PostIsolation6_Drive2.1)
DUO2_PostIsolation7: PostIsolation7/Interface (C24_PostIsolation7_Interface.1 J2_PostIsolation7_Interface.4), PostIsolation7/Drive2 (D6_PostIsolation7_Drive2.1 Q1_PostIsolation7_Drive2.2 R23_PostIsolation7_Drive2.1)
DUO2_PostIsolation8: PostIsolation8/Interface (C24_PostIsolation8_Interface.1 J2_PostIsolation8_Interface.4), PostIsolation8/Drive2 (D6_PostIsolation8_Drive2.1 Q1_PostIsolation8_Drive2.2 R23_PostIsolation8_Drive2.1)
DUO2_PostIsolation9: PostIsolation9/Interface (C24_PostIsolation9_Interface.1 J2_PostIsolation9_Interface.4), PostIsolation9/Drive2 (D6_PostIsolation9_Drive2.1 Q1_PostIsolation9_Drive2.2 R23_PostIsolation9_Drive2.1)
DUO2_PostIsolation10: PostIsolation10/Interface (C24_PostIsolation10_Interface.1 J2_PostIsolation10_Interface.4), PostIsolation10/Drive2 (D6_PostIsolation10_Drive2.1 Q1_PostIsolation10_Drive2.2 R23_PostIsolation10_Drive2.1)
DUO2_PostIsolation11: PostIsolation11/Interface (C24_PostIsolation11_Interface.1 J2_PostIsolation11_Interface.4), PostIsolation11/Drive2 (D6_PostIsolation11_Drive2.1 Q1_PostIsolation11_Drive2.2 R23_PostIsolation11_Drive2.1)
DUO2_PostIsolation12: PostIsolation12/Interface (C24_PostIsolation12_Interface.1 J2_PostIsolation12_Interface.4), PostIsolation12/Drive2 (D6_PostIsolation12_Drive2.1 Q1_PostIsolation12_Drive2.2 R23_PostIsolation12_Drive2.1)
DUO3_PostIsolation1: PostIsolation1/Interface (C25_PostIsolation1_Interface.1 J2_PostIsolation1_Interface.6), PostIsolation1/Drive3 (D6_PostIsolation1_Drive3.1 Q1_PostIsolation1_Drive3.2 R23_PostIsolation1_Drive3.1)
DUO3_PostIsolation2: PostIsolation2/Interface (C25_PostIsolation2_Interface.1 J2_PostIsolation2_Interface.6), PostIsolation2/Drive3 (D6_PostIsolation2_Drive3.1 Q1_PostIsolation2_Drive3.2 R23_PostIsolation2_Drive3.1)
DUO3_PostIsolation3: PostIsolation3/Interface (C25_PostIsolation3_Interface.1 J2_PostIsolation3_Interface.6), PostIsolation3/Drive3 (D6_PostIsolation3_Drive3.1 Q1_PostIsolation3_Drive3.2 R23_PostIsolation3_Drive3.1)
DUO3_PostIsolation4: PostIsolation4/Interface (C25_PostIsolation4_Interface.1 J2_PostIsolation4_Interface.6), PostIsolation4/Drive3 (D6_PostIsolation4_Drive3.1 Q1_PostIsolation4_Drive3.2 R23_PostIsolation4_Drive3.1)
DUO3_PostIsolation5: PostIsolation5/Interface (C25_PostIsolation5_Interface.1 J2_PostIsolation5_Interface.6), PostIsolation5/Drive3 (D6_PostIsolation5_Drive3.1 Q1_PostIsolation5_Drive3.2 R23_PostIsolation5_Drive3.1)
DUO3_PostIsolation6: PostIsolation6/Interface (C25_PostIsolation6_Interface.1 J2_PostIsolation6_Interface.6), PostIsolation6/Drive3 (D6_PostIsolation6_Drive3.1 Q1_PostIsolation6_Drive3.2 R23_PostIsolation6_Drive3.1)
DUO3_PostIsolation7: PostIsolation7/Interface (C25_PostIsolation7_Interface.1 J2_PostIsolation7_Interface.6), PostIsolation7/Drive3 (D6_PostIsolation7_Drive3.1 Q1_PostIsolation7_Drive3.2 R23_PostIsolation7_Drive3.1)
DUO3_PostIsolation8: PostIsolation8/Interface (C25_PostIsolation8_Interface.1 J2_PostIsolation8_Interface.6), PostIsolation8/Drive3 (D6_PostIsolation8_Drive3.1 Q1_PostIsolation8_Drive3.2 R23_PostIsolation8_Drive3.1)
DUO3_PostIsolation9: PostIsolation9/Interface (C25_PostIsolation9_Interface.1 J2_PostIsolation9_Interface.6), PostIsolation9/Drive3 (D6_PostIsolation9_Drive3.1 Q1_PostIsolation9_Drive3.2 R23_PostIsolation9_Drive3.1)
DUO3_PostIsolation10: PostIsolation10/Interface (C25_PostIsolation10_Interface.1 J2_PostIsolation10_Interface.6), PostIsolation10/Drive3 (D6_PostIsolation10_Drive3.1 Q1_PostIsolation10_Drive3.2 R23_PostIsolation10_Drive3.1)
DUO3_PostIsolation11: PostIsolation11/Interface (C25_PostIsolation11_Interface.1 J2_PostIsolation11_Interface.6), PostIsolation11/Drive3 (D6_PostIsolation11_Drive3.1 Q1_PostIsolation11_Drive3.2 R23_PostIsolation11_Drive3.1)
DUO3_PostIsolation12: PostIsolation12/Interface (C25_PostIsolation12_Interface.1 J2_PostIsolation12_Interface.6), PostIsolation12/Drive3 (D6_PostIsolation12_Drive3.1 Q1_PostIsolation12_Drive3.2 R23_PostIsolation12_Drive3.1)
DUO4_PostIsolation1: PostIsolation1/Interface (C26_PostIsolation1_Interface.1 J2_PostIsolation1_Interface.8), PostIsolation1/Drive4 (D6_PostIsolation1_Drive4.1 Q1_PostIsolation1_Drive4.2 R23_PostIsolation1_Drive4.1)
DUO4_PostIsolation2: PostIsolation2/Interface (C26_PostIsolation2_Interface.1 J2_PostIsolation2_Interface.8), PostIsolation2/Drive4 (D6_PostIsolation2_Drive4.1 Q1_PostIsolation2_Drive4.2 R23_PostIsolation2_Drive4.1)
DUO4_PostIsolation3: PostIsolation3/Interface (C26_PostIsolation3_Interface.1 J2_PostIsolation3_Interface.8), PostIsolation3/Drive4 (D6_PostIsolation3_Drive4.1 Q1_PostIsolation3_Drive4.2 R23_PostIsolation3_Drive4.1)
DUO4_PostIsolation4: PostIsolation4/Interface (C26_PostIsolation4_Interface.1 J2_PostIsolation4_Interface.8), PostIsolation4/Drive4 (D6_PostIsolation4_Drive4.1 Q1_PostIsolation4_Drive4.2 R23_PostIsolation4_Drive4.1)
DUO4_PostIsolation5: PostIsolation5/Interface (C26_PostIsolation5_Interface.1 J2_PostIsolation5_Interface.8), PostIsolation5/Drive4 (D6_PostIsolation5_Drive4.1 Q1_PostIsolation5_Drive4.2 R23_PostIsolation5_Drive4.1)
DUO4_PostIsolation6: PostIsolation6/Interface (C26_PostIsolation6_Interface.1 J2_PostIsolation6_Interface.8), PostIsolation6/Drive4 (D6_PostIsolation6_Drive4.1 Q1_PostIsolation6_Drive4.2 R23_PostIsolation6_Drive4.1)
DUO4_PostIsolation7: PostIsolation7/Interface (C26_PostIsolation7_Interface.1 J2_PostIsolation7_Interface.8), PostIsolation7/Drive4 (D6_PostIsolation7_Drive4.1 Q1_PostIsolation7_Drive4.2 R23_PostIsolation7_Drive4.1)
DUO4_PostIsolation8: PostIsolation8/Interface (C26_PostIsolation8_Interface.1 J2_PostIsolation8_Interface.8), PostIsolation8/Drive4 (D6_PostIsolation8_Drive4.1 Q1_PostIsolation8_Drive4.2 R23_PostIsolation8_Drive4.1)
DUO4_PostIsolation9: PostIsolation9/Interface (C26_PostIsolation9_Interface.1 J2_PostIsolation9_Interface.8), PostIsolation9/Drive4 (D6_PostIsolation9_Drive4.1 Q1_PostIsolation9_Drive4.2 R23_PostIsolation9_Drive4.1)
DUO4_PostIsolation10: PostIsolation10/Interface (C26_PostIsolation10_Interface.1 J2_PostIsolation10_Interface.8), PostIsolation10/Drive4 (D6_PostIsolation10_Drive4.1 Q1_PostIsolation10_Drive4.2 R23_PostIsolation10_Drive4.1)
DUO4_PostIsolation11: PostIsolation11/Interface (C26_PostIsolation11_Interface.1 J2_PostIsolation11_Interface.8), PostIsolation11/Drive4 (D6_PostIsolation11_Drive4.1 Q1_PostIsolation11_Drive4.2 R23_PostIsolation11_Drive4.1)
DUO4_PostIsolation12: PostIsolation12/Interface (C26_PostIsolation12_Interface.1 J2_PostIsolation12_Interface.8), PostIsolation12/Drive4 (D6_PostIsolation12_Drive4.1 Q1_PostIsolation12_Drive4.2 R23_PostIsolation12_Drive4.1)
ILO1_PostIsolation1: PostIsolation1/Isolation (U3_PostIsolation1_Isolation.9), PostIsolation1/Drive1 (R24_PostIsolation1_Drive1.1 R25_PostIsolation1_Drive1.1)
ILO1_PostIsolation2: PostIsolation2/Isolation (U3_PostIsolation2_Isolation.9), PostIsolation2/Drive1 (R24_PostIsolation2_Drive1.1 R25_PostIsolation2_Drive1.1)
ILO1_PostIsolation3: PostIsolation3/Isolation (U3_PostIsolation3_Isolation.9), PostIsolation3/Drive1 (R24_PostIsolation3_Drive1.1 R25_PostIsolation3_Drive1.1)
ILO1_PostIsolation4: PostIsolation4/Isolation (U3_PostIsolation4_Isolation.9), PostIsolation4/Drive1 (R24_PostIsolation4_Drive1.1 R25_PostIsolation4_Drive1.1)
ILO1_PostIsolation5: PostIsolation5/Isolation (U3_PostIsolation5_Isolation.9), PostIsolation5/Drive1 (R24_PostIsolation5_Drive1.1 R25_PostIsolation5_Drive1.1)
ILO1_PostIsolation6: PostIsolation6/Isolation (U3_PostIsolation6_Isolation.9), PostIsolation6/Drive1 (R24_PostIsolation6_Drive1.1 R25_PostIsolation6_Drive1.1)
ILO1_PostIsolation7: PostIsolation7/Isolation (U3_PostIsolation7_Isolation.9), PostIsolation7/Drive1 (R24_PostIsolation7_Drive1.1 R25_PostIsolation7_Drive1.1)
ILO1_PostIsolation8: PostIsolation8/Isolation (U3_PostIsolation8_Isolation.9), PostIsolation8/Drive1 (R24_PostIsolation8_Drive1.1 R25_PostIsolation8_Drive1.1)
ILO1_PostIsolation9: PostIsolation9/Isolation (U3_PostIsolation9_Isolation.9), PostIsolation9/Drive1 (R24_PostIsolation9_Drive1.1 R25_PostIsolation9_Drive1.1)
ILO1_PostIsolation10: PostIsolation10/Isolation (U3_PostIsolation10_Isolation.9), PostIsolation10/Drive1 (R24_PostIsolation10_Drive1.1 R25_PostIsolation10_Drive1.1)
ILO1_PostIsolation11: PostIsolation11/Isolation (U3_PostIsolation11_Isolation.9), PostIsolation11/Drive1 (R24_PostIsolation11_Drive1.1 R25_PostIsolation11_Drive1.1)
ILO1_PostIsolation12: PostIsolation12/Isolation (U3_PostIsolation12_Isolation.9), PostIsolation12/Drive1 (R24_PostIsolation12_Drive1.1 R25_PostIsolation12_Drive1.1)
ILO2_PostIsolation1: PostIsolation1/Isolation (U3_PostIsolation1_Isolation.11), PostIsolation1/Drive2 (R24_PostIsolation1_Drive2.1 R25_PostIsolation1_Drive2.1)
ILO2_PostIsolation2: PostIsolation2/Isolation (U3_PostIsolation2_Isolation.11), PostIsolation2/Drive2 (R24_PostIsolation2_Drive2.1 R25_PostIsolation2_Drive2.1)
ILO2_PostIsolation3: PostIsolation3/Isolation (U3_PostIsolation3_Isolation.11), PostIsolation3/Drive2 (R24_PostIsolation3_Drive2.1 R25_PostIsolation3_Drive2.1)
ILO2_PostIsolation4: PostIsolation4/Isolation (U3_PostIsolation4_Isolation.11), PostIsolation4/Drive2 (R24_PostIsolation4_Drive2.1 R25_PostIsolation4_Drive2.1)
ILO2_PostIsolation5: PostIsolation5/Isolation (U3_PostIsolation5_Isolation.11), PostIsolation5/Drive2 (R24_PostIsolation5_Drive2.1 R25_PostIsolation5_Drive2.1)
ILO2_PostIsolation6: PostIsolation6/Isolation (U3_PostIsolation6_Isolation.11), PostIsolation6/Drive2 (R24_PostIsolation6_Drive2.1 R25_PostIsolation6_Drive2.1)
ILO2_PostIsolation7: PostIsolation7/Isolation (U3_PostIsolation7_Isolation.11), PostIsolation7/Drive2 (R24_PostIsolation7_Drive2.1 R25_PostIsolation7_Drive2.1)
ILO2_PostIsolation8: PostIsolation8/Isolation (U3_PostIsolation8_Isolation.11), PostIsolation8/Drive2 (R24_PostIsolation8_Drive2.1 R25_PostIsolation8_Drive2.1)
ILO2_PostIsolation9: PostIsolation9/Isolation (U3_PostIsolation9_Isolation.11), PostIsolation9/Drive2 (R24_PostIsolation9_Drive2.1 R25_PostIsolation9_Drive2.1)
ILO2_PostIsolation10: PostIsolation10/Isolation (U3_PostIsolation10_Isolation.11), PostIsolation10/Drive2 (R24_PostIsolation10_Drive2.1 R25_PostIsolation10_Drive2.1)
ILO2_PostIsolation11: PostIsolation11/Isolation (U3_PostIsolation11_Isolation.11), PostIsolation11/Drive2 (R24_PostIsolation11_Drive2.1 R25_PostIsolation11_Drive2.1)
ILO2_PostIsolation12: PostIsolation12/Isolation (U3_PostIsolation12_Isolation.11), PostIsolation12/Drive2 (R24_PostIsolation12_Drive2.1 R25_PostIsolation12_Drive2.1)
ILO3_PostIsolation1: PostIsolation1/Isolation (U3_PostIsolation1_Isolation.13), PostIsolation1/Drive3 (R24_PostIsolation1_Drive3.1 R25_PostIsolation1_Drive3.1)
ILO3_PostIsolation2: PostIsolation2/Isolation (U3_PostIsolation2_Isolation.13), PostIsolation2/Drive3 (R24_PostIsolation2_Drive3.1 R25_PostIsolation2_Drive3.1)
ILO3_PostIsolation3: PostIsolation3/Isolation (U3_PostIsolation3_Isolation.13), PostIsolation3/Drive3 (R24_PostIsolation3_Drive3.1 R25_PostIsolation3_Drive3.1)
ILO3_PostIsolation4: PostIsolation4/Isolation (U3_PostIsolation4_Isolation.13), PostIsolation4/Drive3 (R24_PostIsolation4_Drive3.1 R25_PostIsolation4_Drive3.1)
ILO3_PostIsolation5: PostIsolation5/Isolation (U3_PostIsolation5_Isolation.13), PostIsolation5/Drive3 (R24_PostIsolation5_Drive3.1 R25_PostIsolation5_Drive3.1)
ILO3_PostIsolation6: PostIsolation6/Isolation (U3_PostIsolation6_Isolation.13), PostIsolation6/Drive3 (R24_PostIsolation6_Drive3.1 R25_PostIsolation6_Drive3.1)
ILO3_PostIsolation7: PostIsolation7/Isolation (U3_PostIsolation7_Isolation.13), PostIsolation7/Drive3 (R24_PostIsolation7_Drive3.1 R25_PostIsolation7_Drive3.1)
ILO3_PostIsolation8: PostIsolation8/Isolation (U3_PostIsolation8_Isolation.13), PostIsolation8/Drive3 (R24_PostIsolation8_Drive3.1 R25_PostIsolation8_Drive3.1)
ILO3_PostIsolation9: PostIsolation9/Isolation (U3_PostIsolation9_Isolation.13), PostIsolation9/Drive3 (R24_PostIsolation9_Drive3.1 R25_PostIsolation9_Drive3.1)
ILO3_PostIsolation10: PostIsolation10/Isolation (U3_PostIsolation10_Isolation.13), PostIsolation10/Drive3 (R24_PostIsolation10_Drive3.1 R25_PostIsolation10_Drive3.1)
ILO3_PostIsolation11: PostIsolation11/Isolation (U3_PostIsolation11_Isolation.13), PostIsolation11/Drive3 (R24_PostIsolation11_Drive3.1 R25_PostIsolation11_Drive3.1)
ILO3_PostIsolation12: PostIsolation12/Isolation (U3_PostIsolation12_Isolation.13), PostIsolation12/Drive3 (R24_PostIsolation12_Drive3.1 R25_PostIsolation12_Drive3.1)
ILO4_PostIsolation1: PostIsolation1/Isolation (U3_PostIsolation1_Isolation.15), PostIsolation1/Drive4 (R24_PostIsolation1_Drive4.1 R25_PostIsolation1_Drive4.1)
ILO4_PostIsolation2: PostIsolation2/Isolation (U3_PostIsolation2_Isolation.15), PostIsolation2/Drive4 (R24_PostIsolation2_Drive4.1 R25_PostIsolation2_Drive4.1)
ILO4_PostIsolation3: PostIsolation3/Isolation (U3_PostIsolation3_Isolation.15), PostIsolation3/Drive4 (R24_PostIsolation3_Drive4.1 R25_PostIsolation3_Drive4.1)
ILO4_PostIsolation4: PostIsolation4/Isolation (U3_PostIsolation4_Isolation.15), PostIsolation4/Drive4 (R24_PostIsolation4_Drive4.1 R25_PostIsolation4_Drive4.1)
ILO4_PostIsolation5: PostIsolation5/Isolation (U3_PostIsolation5_Isolation.15), PostIsolation5/Drive4 (R24_PostIsolation5_Drive4.1 R25_PostIsolation5_Drive4.1)
ILO4_PostIsolation6: PostIsolation6/Isolation (U3_PostIsolation6_Isolation.15), PostIsolation6/Drive4 (R24_PostIsolation6_Drive4.1 R25_PostIsolation6_Drive4.1)
ILO4_PostIsolation7: PostIsolation7/Isolation (U3_PostIsolation7_Isolation.15), PostIsolation7/Drive4 (R24_PostIsolation7_Drive4.1 R25_PostIsolation7_Drive4.1)
ILO4_PostIsolation8: PostIsolation8/Isolation (U3_PostIsolation8_Isolation.15), PostIsolation8/Drive4 (R24_PostIsolation8_Drive4.1 R25_PostIsolation8_Drive4.1)
ILO4_PostIsolation9: PostIsolation9/Isolation (U3_PostIsolation9_Isolation.15), PostIsolation9/Drive4 (R24_PostIsolation9_Drive4.1 R25_PostIsolation9_Drive4.1)
ILO4_PostIsolation10: PostIsolation10/Isolation (U3_PostIsolation10_Isolation.15), PostIsolation10/Drive4 (R24_PostIsolation10_Drive4.1 R25_PostIsolation10_Drive4.1)
ILO4_PostIsolation11: PostIsolation11/Isolation (U3_PostIsolation11_Isolation.15), PostIsolation11/Drive4 (R24_PostIsolation11_Drive4.1 R25_PostIsolation11_Drive4.1)
ILO4_PostIsolation12: PostIsolation12/Isolation (U3_PostIsolation12_Isolation.15), PostIsolation12/Drive4 (R24_PostIsolation12_Drive4.1 R25_PostIsolation12_Drive4.1)
IUO1_PostIsolation1: PostIsolation1/Isolation (U2_PostIsolation1_Isolation.15), PostIsolation1/Drive1 (C28_PostIsolation1_Drive1.2 Q3_PostIsolation1_Drive1.G R28_PostIsolation1_Drive1.2)
IUO1_PostIsolation2: PostIsolation2/Isolation (U2_PostIsolation2_Isolation.15), PostIsolation2/Drive1 (C28_PostIsolation2_Drive1.2 Q3_PostIsolation2_Drive1.G R28_PostIsolation2_Drive1.2)
IUO1_PostIsolation3: PostIsolation3/Isolation (U2_PostIsolation3_Isolation.15), PostIsolation3/Drive1 (C28_PostIsolation3_Drive1.2 Q3_PostIsolation3_Drive1.G R28_PostIsolation3_Drive1.2)
IUO1_PostIsolation4: PostIsolation4/Isolation (U2_PostIsolation4_Isolation.15), PostIsolation4/Drive1 (C28_PostIsolation4_Drive1.2 Q3_PostIsolation4_Drive1.G R28_PostIsolation4_Drive1.2)
IUO1_PostIsolation5: PostIsolation5/Isolation (U2_PostIsolation5_Isolation.15), PostIsolation5/Drive1 (C28_PostIsolation5_Drive1.2 Q3_PostIsolation5_Drive1.G R28_PostIsolation5_Drive1.2)
IUO1_PostIsolation6: PostIsolation6/Isolation (U2_PostIsolation6_Isolation.15), PostIsolation6/Drive1 (C28_PostIsolation6_Drive1.2 Q3_PostIsolation6_Drive1.G R28_PostIsolation6_Drive1.2)
IUO1_PostIsolation7: PostIsolation7/Isolation (U2_PostIsolation7_Isolation.15), PostIsolation7/Drive1 (C28_PostIsolation7_Drive1.2 Q3_PostIsolation7_Drive1.G R28_PostIsolation7_Drive1.2)
IUO1_PostIsolation8: PostIsolation8/Isolation (U2_PostIsolation8_Isolation.15), PostIsolation8/Drive1 (C28_PostIsolation8_Drive1.2 Q3_PostIsolation8_Drive1.G R28_PostIsolation8_Drive1.2)
IUO1_PostIsolation9: PostIsolation9/Isolation (U2_PostIsolation9_Isolation.15), PostIsolation9/Drive1 (C28_PostIsolation9_Drive1.2 Q3_PostIsolation9_Drive1.G R28_PostIsolation9_Drive1.2)
IUO1_PostIsolation10: PostIsolation10/Isolation (U2_PostIsolation10_Isolation.15), PostIsolation10/Drive1 (C28_PostIsolation10_Drive1.2 Q3_PostIsolation10_Drive1.G R28_PostIsolation10_Drive1.2)
IUO1_PostIsolation11: PostIsolation11/Isolation (U2_PostIsolation11_Isolation.15), PostIsolation11/Drive1 (C28_PostIsolation11_Drive1.2 Q3_PostIsolation11_Drive1.G R28_PostIsolation11_Drive1.2)
IUO1_PostIsolation12: PostIsolation12/Isolation (U2_PostIsolation12_Isolation.15), PostIsolation12/Drive1 (C28_PostIsolation12_Drive1.2 Q3_PostIsolation12_Drive1.G R28_PostIsolation12_Drive1.2)
IUO2_PostIsolation1: PostIsolation1/Isolation (U2_PostIsolation1_Isolation.13), PostIsolation1/Drive2 (C28_PostIsolation1_Drive2.2 Q3_PostIsolation1_Drive2.G R28_PostIsolation1_Drive2.2)
IUO2_PostIsolation2: PostIsolation2/Isolation (U2_PostIsolation2_Isolation.13), PostIsolation2/Drive2 (C28_PostIsolation2_Drive2.2 Q3_PostIsolation2_Drive2.G R28_PostIsolation2_Drive2.2)
IUO2_PostIsolation3: PostIsolation3/Isolation (U2_PostIsolation3_Isolation.13), PostIsolation3/Drive2 (C28_PostIsolation3_Drive2.2 Q3_PostIsolation3_Drive2.G R28_PostIsolation3_Drive2.2)
IUO2_PostIsolation4: PostIsolation4/Isolation (U2_PostIsolation4_Isolation.13), PostIsolation4/Drive2 (C28_PostIsolation4_Drive2.2 Q3_PostIsolation4_Drive2.G R28_PostIsolation4_Drive2.2)
IUO2_PostIsolation5: PostIsolation5/Isolation (U2_PostIsolation5_Isolation.13), PostIsolation5/Drive2 (C28_PostIsolation5_Drive2.2 Q3_PostIsolation5_Drive2.G R28_PostIsolation5_Drive2.2)
IUO2_PostIsolation6: PostIsolation6/Isolation (U2_PostIsolation6_Isolation.13), PostIsolation6/Drive2 (C28_PostIsolation6_Drive2.2 Q3_PostIsolation6_Drive2.G R28_PostIsolation6_Drive2.2)
IUO2_PostIsolation7: PostIsolation7/Isolation (U2_PostIsolation7_Isolation.13), PostIsolation7/Drive2 (C28_PostIsolation7_Drive2.2 Q3_PostIsolation7_Drive2.G R28_PostIsolation7_Drive2.2)
IUO2_PostIsolation8: PostIsolation8/Isolation (U2_PostIsolation8_Isolation.13), PostIsolation8/Drive2 (C28_PostIsolation8_Drive2.2 Q3_PostIsolation8_Drive2.G R28_PostIsolation8_Drive2.2)
IUO2_PostIsolation9: PostIsolation9/Isolation (U2_PostIsolation9_Isolation.13), PostIsolation9/Drive2 (C28_PostIsolation9_Drive2.2 Q3_PostIsolation9_Drive2.G R28_PostIsolation9_Drive2.2)
IUO2_PostIsolation10: PostIsolation10/Isolation (U2_PostIsolation10_Isolation.13), PostIsolation10/Drive2 (C28_PostIsolation10_Drive2.2 Q3_PostIsolation10_Drive2.G R28_PostIsolation10_Drive2.2)
IUO2_PostIsolation11: PostIsolation11/Isolation (U2_PostIsolation11_Isolation.13), PostIsolation11/Drive2 (C28_PostIsolation11_Drive2.2 Q3_PostIsolation11_Drive2.G R28_PostIsolation11_Drive2.2)
IUO2_PostIsolation12: PostIsolation12/Isolation (U2_PostIsolation12_Isolation.13), PostIsolation12/Drive2 (C28_PostIsolation12_Drive2.2 Q3_PostIsolation12_Drive2.G R28_PostIsolation12_Drive2.2)
IUO3_PostIsolation1: PostIsolation1/Isolation (U2_PostIsolation1_Isolation.11), PostIsolation1/Drive3 (C28_PostIsolation1_Drive3.2 Q3_PostIsolation1_Drive3.G R28_PostIsolation1_Drive3.2)
IUO3_PostIsolation2: PostIsolation2/Isolation (U2_PostIsolation2_Isolation.11), PostIsolation2/Drive3 (C28_PostIsolation2_Drive3.2 Q3_PostIsolation2_Drive3.G R28_PostIsolation2_Drive3.2)
IUO3_PostIsolation3: PostIsolation3/Isolation (U2_PostIsolation3_Isolation.11), PostIsolation3/Drive3 (C28_PostIsolation3_Drive3.2 Q3_PostIsolation3_Drive3.G R28_PostIsolation3_Drive3.2)
IUO3_PostIsolation4: PostIsolation4/Isolation (U2_PostIsolation4_Isolation.11), PostIsolation4/Drive3 (C28_PostIsolation4_Drive3.2 Q3_PostIsolation4_Drive3.G R28_PostIsolation4_Drive3.2)
IUO3_PostIsolation5: PostIsolation5/Isolation (U2_PostIsolation5_Isolation.11), PostIsolation5/Drive3 (C28_PostIsolation5_Drive3.2 Q3_PostIsolation5_Drive3.G R28_PostIsolation5_Drive3.2)
IUO3_PostIsolation6: PostIsolation6/Isolation (U2_PostIsolation6_Isolation.11), PostIsolation6/Drive3 (C28_PostIsolation6_Drive3.2 Q3_PostIsolation6_Drive3.G R28_PostIsolation6_Drive3.2)
IUO3_PostIsolation7: PostIsolation7/Isolation (U2_PostIsolation7_Isolation.11), PostIsolation7/Drive3 (C28_PostIsolation7_Drive3.2 Q3_PostIsolation7_Drive3.G R28_PostIsolation7_Drive3.2)
IUO3_PostIsolation8: PostIsolation8/Isolation (U2_PostIsolation8_Isolation.11), PostIsolation8/Drive3 (C28_PostIsolation8_Drive3.2 Q3_PostIsolation8_Drive3.G R28_PostIsolation8_Drive3.2)
IUO3_PostIsolation9: PostIsolation9/Isolation (U2_PostIsolation9_Isolation.11), PostIsolation9/Drive3 (C28_PostIsolation9_Drive3.2 Q3_PostIsolation9_Drive3.G R28_PostIsolation9_Drive3.2)
IUO3_PostIsolation10: PostIsolation10/Isolation (U2_PostIsolation10_Isolation.11), PostIsolation10/Drive3 (C28_PostIsolation10_Drive3.2 Q3_PostIsolation10_Drive3.G R28_PostIsolation10_Drive3.2)
IUO3_PostIsolation11: PostIsolation11/Isolation (U2_PostIsolation11_Isolation.11), PostIsolation11/Drive3 (C28_PostIsolation11_Drive3.2 Q3_PostIsolation11_Drive3.G R28_PostIsolation11_Drive3.2)
IUO3_PostIsolation12: PostIsolation12/Isolation (U2_PostIsolation12_Isolation.11), PostIsolation12/Drive3 (C28_PostIsolation12_Drive3.2 Q3_PostIsolation12_Drive3.G R28_PostIsolation12_Drive3.2)
IUO4_PostIsolation1: PostIsolation1/Isolation (U2_PostIsolation1_Isolation.9), PostIsolation1/Drive4 (C28_PostIsolation1_Drive4.2 Q3_PostIsolation1_Drive4.G R28_PostIsolation1_Drive4.2)
IUO4_PostIsolation2: PostIsolation2/Isolation (U2_PostIsolation2_Isolation.9), PostIsolation2/Drive4 (C28_PostIsolation2_Drive4.2 Q3_PostIsolation2_Drive4.G R28_PostIsolation2_Drive4.2)
IUO4_PostIsolation3: PostIsolation3/Isolation (U2_PostIsolation3_Isolation.9), PostIsolation3/Drive4 (C28_PostIsolation3_Drive4.2 Q3_PostIsolation3_Drive4.G R28_PostIsolation3_Drive4.2)
IUO4_PostIsolation4: PostIsolation4/Isolation (U2_PostIsolation4_Isolation.9), PostIsolation4/Drive4 (C28_PostIsolation4_Drive4.2 Q3_PostIsolation4_Drive4.G R28_PostIsolation4_Drive4.2)
IUO4_PostIsolation5: PostIsolation5/Isolation (U2_PostIsolation5_Isolation.9), PostIsolation5/Drive4 (C28_PostIsolation5_Drive4.2 Q3_PostIsolation5_Drive4.G R28_PostIsolation5_Drive4.2)
IUO4_PostIsolation6: PostIsolation6/Isolation (U2_PostIsolation6_Isolation.9), PostIsolation6/Drive4 (C28_PostIsolation6_Drive4.2 Q3_PostIsolation6_Drive4.G R28_PostIsolation6_Drive4.2)
IUO4_PostIsolation7: PostIsolation7/Isolation (U2_PostIsolation7_Isolation.9), PostIsolation7/Drive4 (C28_PostIsolation7_Drive4.2 Q3_PostIsolation7_Drive4.G R28_PostIsolation7_Drive4.2)
IUO4_PostIsolation8: PostIsolation8/Isolation (U2_PostIsolation8_Isolation.9), PostIsolation8/Drive4 (C28_PostIsolation8_Drive4.2 Q3_PostIsolation8_Drive4.G R28_PostIsolation8_Drive4.2)
IUO4_PostIsolation9: PostIsolation9/Isolation (U2_PostIsolation9_Isolation.9), PostIsolation9/Drive4 (C28_PostIsolation9_Drive4.2 Q3_PostIsolation9_Drive4.G R28_PostIsolation9_Drive4.2)
IUO4_PostIsolation10: PostIsolation10/Isolation (U2_PostIsolation10_Isolation.9), PostIsolation10/Drive4 (C28_PostIsolation10_Drive4.2 Q3_PostIsolation10_Drive4.G R28_PostIsolation10_Drive4.2)
IUO4_PostIsolation11: PostIsolation11/Isolation (U2_PostIsolation11_Isolation.9), PostIsolation11/Drive4 (C28_PostIsolation11_Drive4.2 Q3_PostIsolation11_Drive4.G R28_PostIsolation11_Drive4.2)
IUO4_PostIsolation12: PostIsolation12/Isolation (U2_PostIsolation12_Isolation.9), PostIsolation12/Drive4 (C28_PostIsolation12_Drive4.2 Q3_PostIsolation12_Drive4.G R28_PostIsolation12_Drive4.2)
SCLK: VALVEBOARD_Controller (U1.40), VALVEBOARD_DigitalInterface (R50.1)
SDATA: VALVEBOARD_Controller (U1.41), VALVEBOARD_DigitalInterface (R51.1)
SEN: VALVEBOARD_Controller (U1.39), VALVEBOARD_DigitalInterface (R49.1)